# EAGLE design sersors (EAGLE 4.16)
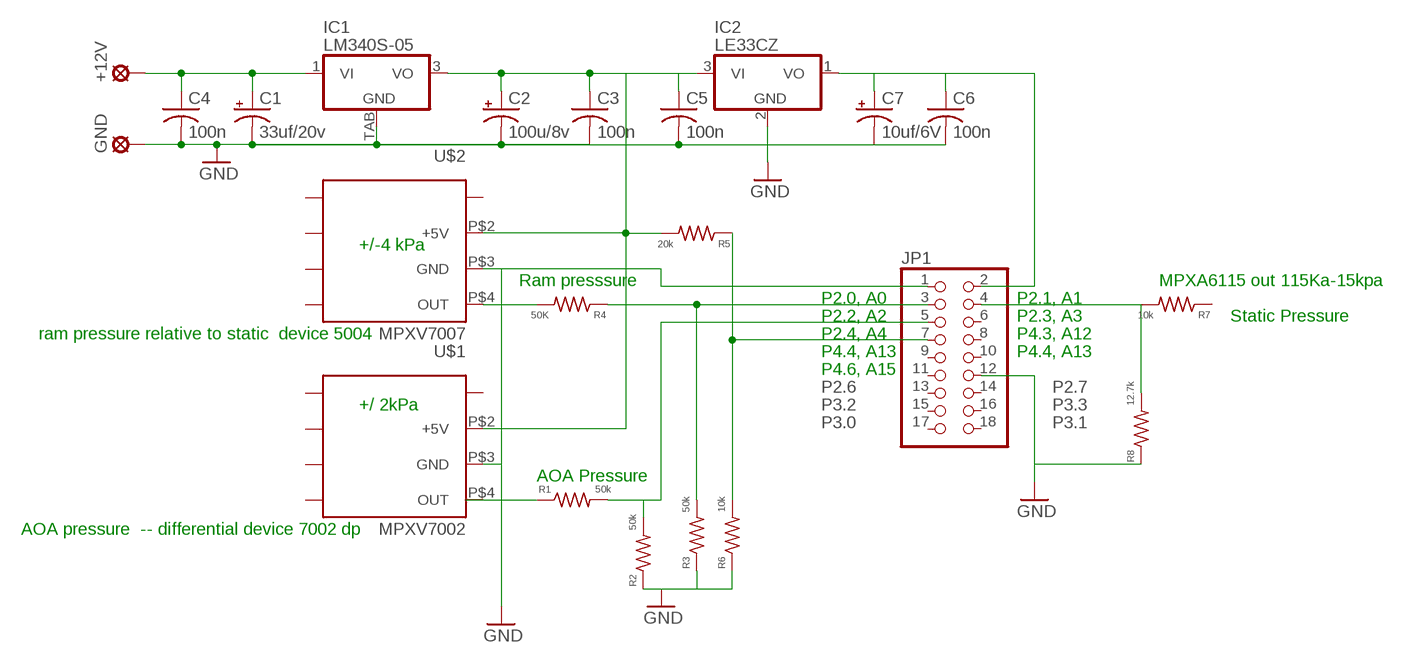
[diagram p0: schematic, sheet 1]

## Parts
+12V  LSP10  [LSP10]
C1  33uf/20v  CPOL-USSMCD  [SMC_D]
C2  100u/8v  CPOL-USSMCD  [SMC_D]
C3  100n  C-USC1206K  [C1206K]
C4  100n  C-USC1206K  [C1206K]
C5  100n  C-USC1206K  [C1206K]
C6  100n  C-USC1206  [C1206]
C7  10uf/6V  CPOL-USSMCB  [SMC_B]
GND  LSP10  [LSP10]
IC1  LM340S-05  [TO263-3]
IC2  LE33CZ  [TO92-]
JP1  PINHD-2X9  [2X09]
R1  50k  R-US_0207/10  [0207/10]
R2  50k  R-US_0207/10  [0207/10]
R3  50k  R-US_0207/10  [0207/10]
R4  50K  R-US_0207/10  [0207/10]
R5  20k  R-US_0207/10  [0207/10]
R6  10k  R-US_0207/10  [0207/10]
R7  10k  R-US_0207/10  [0207/10]
R8  12.7k  R-US_0207/10  [0207/10]
U$1  MPXV7002  [MPXV]
U$2  MPXV7007  [MPXV]

## Nets
GND: C1.- C2.- C3.2 C4.2 C5.2 C6.2 C7.- GND.MP IC1.TAB(GND) IC2.2(GND) JP1.1 JP1.12 R2.1 R3.1 R6.1 R8.1 U$1.P$3(GND) U$2.P$3(GND)
N$1: +12V.MP C1.+ C4.1 IC1.1(VI)
N$2: R4.2 U$2.P$4(OUT)
N$3: C2.+ C3.1 C5.1 IC1.3(VO) IC2.3(VI) R5.2 U$1.P$2(+5V) U$2.P$2(+5V)
N$4: R1.1 U$1.P$4(OUT)
N$5: JP1.5 R1.2 R2.2
N$6: JP1.3 R3.2 R4.1
N$7: JP1.7 R5.1 R6.2
N$8: C6.1 C7.+ IC2.1(VO) JP1.2
N$9: JP1.4 R7.2 R8.2
Unconnected: JP1.6 JP1.8 JP1.9 JP1.10 JP1.11 JP1.13 JP1.14 JP1.15 JP1.16 JP1.17 JP1.18 R7.1 U$1.P$1 U$1.P$5 U$1.P$6 U$1.P$7 U$1.P$8 U$2.P$1 U$2.P$5 U$2.P$6 U$2.P$7 U$2.P$8

## Notes on the sheet
- +/-4 kPa
- Ram presssure | MPXA6115 out 115Ka-15kpa
- P2.0, A0 | P2.1, A1
- P2.2, A2 | P2.3, A3 | Static Pressure
- ram pressure relative to static  device 5004 | P2.4, A4 | P4.3, A12
- P4.4, A13 | P4.4, A13
- P4.6, A15
- P2.6 | P2.7
- +/ 2kPa | P3.2 | P3.3
- P3.0 | P3.1
- AOA Pressure
- AOA pressure  -- differential device 7002 dp

## Library data of the parts
+12V GND = solpad:LSP10: SOLDER PAD drill 1.0 mm, distributor Buerklin, 12H555
C1 C2 C7 = rcl:CPOL-US: POLARIZED CAPACITOR, American symbol
C3-C6 = rcl:C-US: CAPACITOR, American symbol
IC1 = Stofer:LM340?-*: Positive VOLTAGE REGULATOR Source: http://cache.national.com/ds/LM/LM340.pdf
IC2 = ZStofer:LE33CZ: 3.3V LDO regularor
JP1 = pinhead:PINHD-2X9: PIN HEADER
R1-R8 = rcl:R-US_: RESISTOR, American symbol
U$1 = ZStofer:MPXV7002: 2Kpa dual port pressure sensor
U$2 = ZStofer:MPXV7007: 7Kpa dual port pressure sensor

## Board
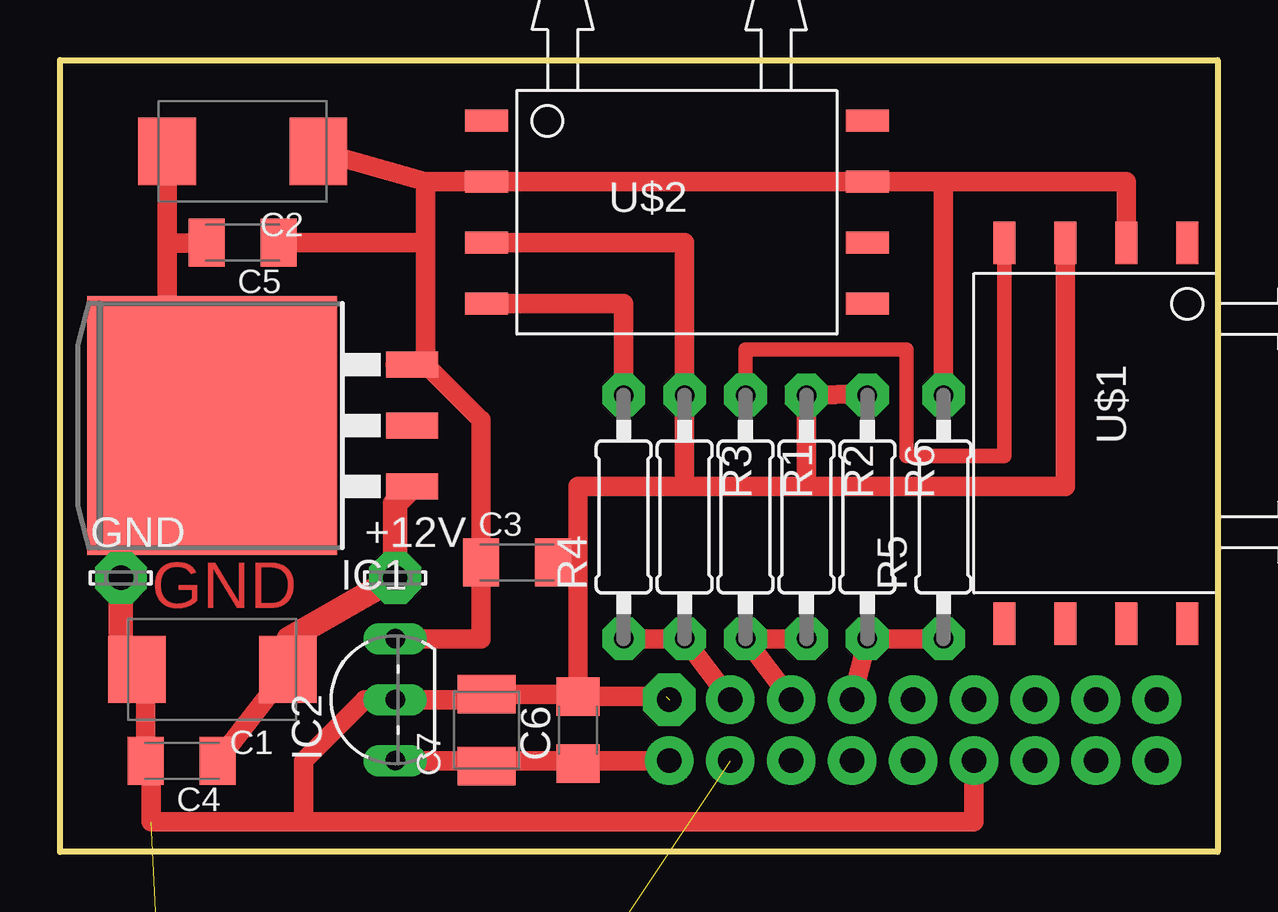
[diagram p1: board, top side]
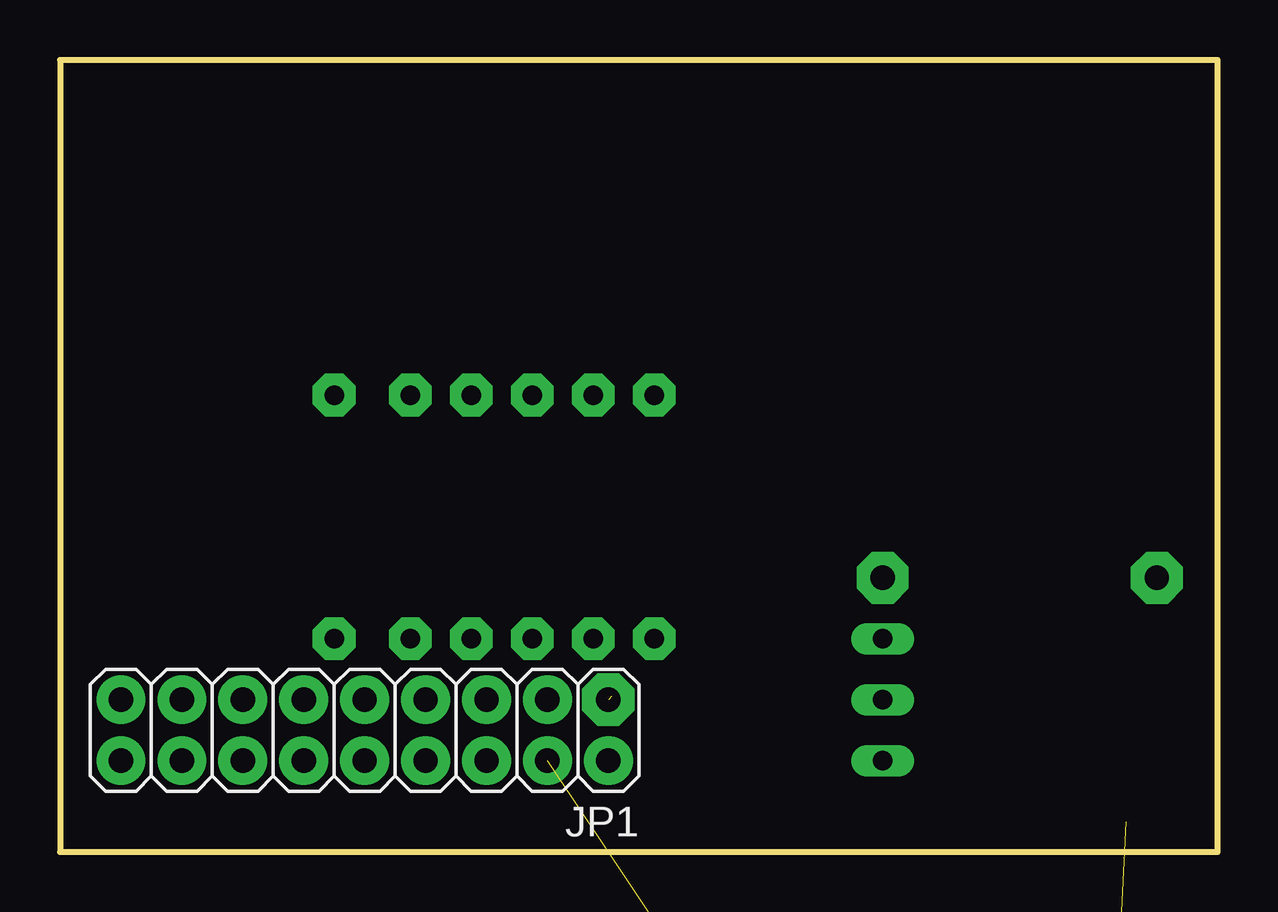
[diagram p2: board, bottom side, seen from below]

Size 48.26 x 33.02 mm. Coordinates in mm from the lower left corner, seen from the top.
Outline: 0,33.02 48.26,33.02 48.26,0 0,0 0,33.02
Copper layers (1*2+15*16): Top 0.035mm / dielectric 0.2mm / Route2 0.035mm / dielectric 0.15mm / Route15 0.035mm / dielectric 0.2mm / Bottom 0.035mm
Design rules "default": minimum track width 10mil, minimum drill 24mil, track to track 8mil, track to pad 8mil, pad to pad 8mil, via to via 8mil, smd to smd 8mil, copper to edge 40mil, drill to drill 8mil, minimum pad ring 10mil, minimum via ring 8mil, stop-mask expansion 4mil, vias tented up to drill 0mil, thermal gap 10mil

### Footprints (pad centres in the part's own frame; a part is rotated, then mirrored left to right if it is on the bottom)
LSP10 = drill 1.016 pad 2.159 octagon: MP 0,0
SMC_D = smd 2.4 x 2.8: + -3.15,0; - 3.15,0
C1206K = smd 1.5 x 2: 1 -1.5,0; 2 1.5,0
C1206 = smd 1.6 x 1.8: 1 -1.4,0; 2 1.4,0
SMC_B = smd 1.6 x 2.4: + -1.5,0; - 1.5,0
TO263-3 = smd 1.067 x 2.159: 1 -2.54,-5.791; 2 0,-5.791; 3 2.54,-5.791 | smd 10.8 x 10.41: TAB 0,2.54
TO92- = drill 0.813 long: 1 -2.54,-1.27; 2 0,-1.27; 3 2.54,-1.27
2X09 = drill 1.016 pad 2.184 octagon: 1 -10.16,-1.27 | drill 1.016 pad 2.032 round: 2 -10.16,1.27; 3 -7.62,-1.27; 4 -7.62,1.27; 5 -5.08,-1.27; 6 -5.08,1.27; 7 -2.54,-1.27; 8 -2.54,1.27; 9 0,-1.27; 10 0,1.27; 11 2.54,-1.27; 12 2.54,1.27; 13 5.08,-1.27; 14 5.08,1.27; 15 7.62,-1.27; 16 7.62,1.27; 17 10.16,-1.27; 18 10.16,1.27
0207/10 = drill 0.813 pad 1.778 octagon: 1 -5.08,0; 2 5.08,0
MPXV = smd 1.778 x 0.914: P$1 0,0; P$2 0,-2.54; P$3 0,-5.08; P$4 0,-7.62; P$5 15.875,-7.62; P$6 15.875,-5.08; P$7 15.875,-2.54; P$8 15.875,0

### Placement (x,y rotation side)
+12V  13.97,11.43 0 top
C1  6.35,7.62 180 top
C2  7.62,29.21 180 top
C3  19.05,12.07 0 top
C4  5.08,3.81 180 top
C5  7.62,25.4 180 top
C6  21.59,5.08 90 top
C7  17.78,5.08 90 top
GND  2.54,11.43 0 top
IC1  8.89,17.78 90 top
IC2  12.7,6.35 90 top
JP1  35.56,5.08 180 bottom
R1  28.58,13.97 270 top
R2  31.12,13.97 270 top
R3  26.03,13.97 270 top
R4  23.49,13.97 90 top
R5  36.83,13.97 90 top
R6  33.66,13.97 270 top
R7  15.24,-7.62 0 top  (outside the outline)
R8  10.16,-24.13 0 top  (outside the outline)
U$1  46.99,25.4 270 top
U$2  17.78,30.48 0 top

### Tracks (layer width: path | path; a pad name or v marks a point on that pad's centre or on a via)
GND  (2 unrouted)
  Top 0.61: 6.1,25.38 C5.2
  Top 0.813: 2.54,16.51 6.35,16.51 IC1.TAB 5.08,19.05 5.08,20.32 4.47,20.93 4.47,25.38 | 10.16,1.27 3.81,1.27 3.81,3.81 C4.2 3.58,7.21 3.18,7.62 | 10.16,1.27 10.16,3.81 12.7,6.35 IC2.2 17.78,6.35 C7.- 21.36,6.58 21.59,6.35 | 25.27,6.48 C6.2 21.59,6.35 | JP1.12 38.1,1.27 10.16,1.27 | 26.03,15.24 21.59,15.24 21.59,12.7 | 26.03,15.24 31.12,15.24 | 21.59,6.35 21.59,12.7 | 21.59,12.7 21.19,12.29 | C3.2 20.95,12.07 21.59,12.7 | 31.12,15.24 R2.1 33.62,19.09 R6.1 | 31.12,15.24 41.91,15.24 U$1.P$3 | U$2.P$3 26.03,25.4 R3.1 26.03,15.24 | 4.47,25.38 C2.- | 4.47,25.38 6.1,25.38
  Top 1.016: IC1.TAB 2.54,13.97 GND.MP 2.54,7.62 3.18,7.62 C1.-
N$1
  Top 0.813: C1.+ 9.52,7.62 C4.1
  Top 1.016: IC1.1 13.97,14.53 +12V.MP 9.52,8.89 C1.+
N$2
  Top 0.813: U$2.P$4 23.49,22.86 R4.2
N$3
  Top 0.813: 15.24,20.32 17.55,18.01 C3.1 17.55,8.89 IC2.3 | 13.97,20.32 IC1.3 15.24,20.32 | 15.24,20.32 15.24,25.4 | 15.24,25.4 15.24,27.94 | 15.24,27.94 U$2.P$2 36.83,27.94 | 36.83,27.94 44.45,27.94 U$1.P$2 | 15.24,27.94 C2.+ | 36.83,27.94 R5.2 | 15.24,25.4 C5.1
N$4
  Top 0.61: R1.1 28.58,20.96 35.29,20.96 35.29,16.51 39.37,16.51 U$1.P$4
N$5
  Top 0.813: JP1.5 R1.2 R2.2
N$6
  Top 0.813: R4.1 R3.2 JP1.3
N$7
  Top 0.813: JP1.7 R6.2 R5.1
N$8
  Top 0.813: IC2.1 17.78,3.81 | JP1.2 21.59,3.81 C6.1 21.46,3.81 17.78,3.81 | 17.78,3.81 C7.+
N$9  (2 unrouted)

### Text on the board
Top: GND